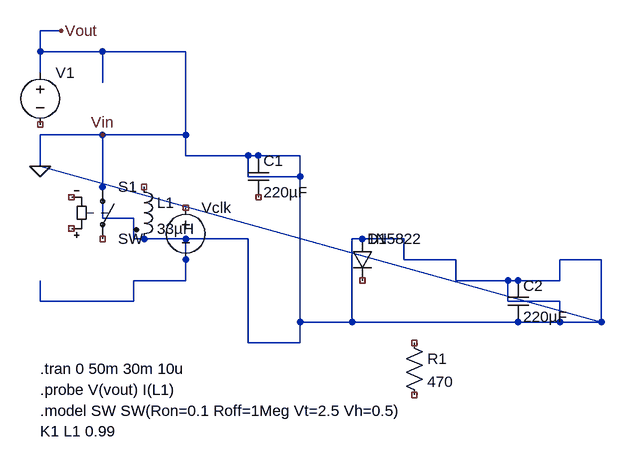
[diagram p0: schematic LM2596_substitute.asc]
LM2596_substitute.asc, the LTspice schematic file:
Version 4
SHEET 1 880 680
WIRE -32 64 -32 96
WIRE -32 64 64 64
WIRE 64 64 64 112
WIRE -32 192 -32 240
WIRE 64 192 64 256
WIRE -32 192 64 192
WIRE 64 192 192 192
WIRE 192 192 192 224
WIRE 192 224 288 224
WIRE 288 224 288 256
WIRE 288 256 368 256
WIRE 368 256 368 480
WIRE 64 256 64 320
WIRE 64 320 112 320
WIRE 112 320 112 352
WIRE 112 352 192 352
WIRE 192 352 192 416
WIRE 192 416 112 416
WIRE 112 416 112 448
WIRE 112 448 -32 448
WIRE -32 448 -32 416
WIRE 192 352 288 352
WIRE 288 352 288 480
WIRE 64 64 192 64
WIRE 192 64 192 192
WIRE 288 224 368 224
WIRE 368 224 368 256
WIRE -32 64 -32 32
WIRE -32 32 0 32
WIRE 368 480 768 480
WIRE 768 480 768 448
WIRE 768 448 688 448
WIRE 688 448 688 416
WIRE 688 416 608 416
WIRE 608 416 608 384
WIRE 608 384 528 384
WIRE 528 384 528 352
WIRE 528 352 448 352
WIRE 448 352 448 480
WIRE 448 480 368 480
WIRE 368 480 368 512
WIRE 368 512 288 512
WIRE 288 512 288 480
WIRE 688 416 768 416
WIRE 768 416 768 384
WIRE 768 384 832 384
WIRE 832 384 832 480
WIRE 832 480 768 480
WIRE -32 240 832 480
FLAG 0 32 Vout
FLAG -32 240 0
FLAG 64 192 Vin
SYMBOL voltage -32 80 R0
WINDOW 3 24 96 Invisible 0
WINDOW 123 24 0 Left 0
WINDOW 39 0 0 Left 0
SYMATTR Value SINE(0 12 1)
SYMATTR InstName V1
SYMBOL ind2 112 256 R0
SYMATTR Value 33µH
SYMATTR InstName L1
SYMBOL cap 288 224 R0
SYMATTR Value 220µF
SYMATTR InstName C1
SYMBOL diode 448 352 R0
WINDOW 3 24 0 Left 0
SYMATTR Value 1N5822
SYMATTR InstName D1
SYMBOL res 528 496 R0
SYMATTR Value 470
SYMATTR InstName R1
SYMBOL cap 688 416 R0
SYMATTR Value 220µF
SYMATTR InstName C2
SYMBOL sw 64 256 R0
SYMATTR InstName S1
SYMBOL voltage 192 288 R0
WINDOW 3 24 96 Invisible 0
WINDOW 123 24 0 Left 0
WINDOW 39 0 0 Left 0
SYMATTR Value PULSE(0 5 0 50n 50n 3.6u 7.2u)
SYMATTR InstName Vclk
TEXT -32 552 Left 0 !.tran 0 50m 30m 10u
TEXT -32 584 Left 0 !.probe V(vout) I(L1)
TEXT -32 616 Left 0 !.model SW SW(Ron=0.1 Roff=1Meg Vt=2.5 Vh=0.5)
TEXT -32 648 Left 0 !K1 L1 0.99

The netlist it stands for:
* LM2596_substitute.asc
V1 0 NC_01 SINE(0 12 1)
L1 NC_02 0 33µH
C1 0 NC_03 220µF
D1 0 NC_04 1N5822
R1 NC_05 NC_06 470
C2 0 0 220µF
S1 0 NC_07 NC_08 NC_09 SW
Vclk NC_10 0 PULSE(0 5 0 50n 50n 3.6u 7.2u)
.model D D
.lib standard.dio
.tran 0 50m 30m 10u
.probe V(vout) I(L1)
.model SW SW(Ron=0.1 Roff=1Meg Vt=2.5 Vh=0.5)
K1 L1 0.99
.backanno
.end